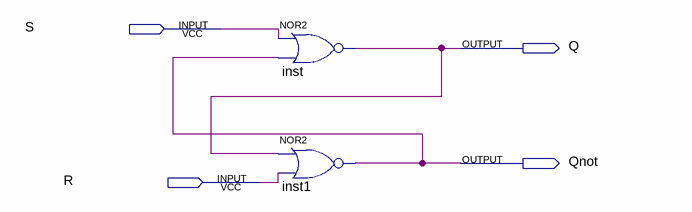
[diagram p0: schematic sheet]
// Quartus schematic RS-trigger.bdf as structural Verilog: 2 symbols, 4 pins
module \RS-trigger  (
  input  S,
  input  R,
  output Q,
  output Qnot
);

  nor inst (Q, S, Qnot);
  nor inst1 (Qnot, Q, R);
endmodule
